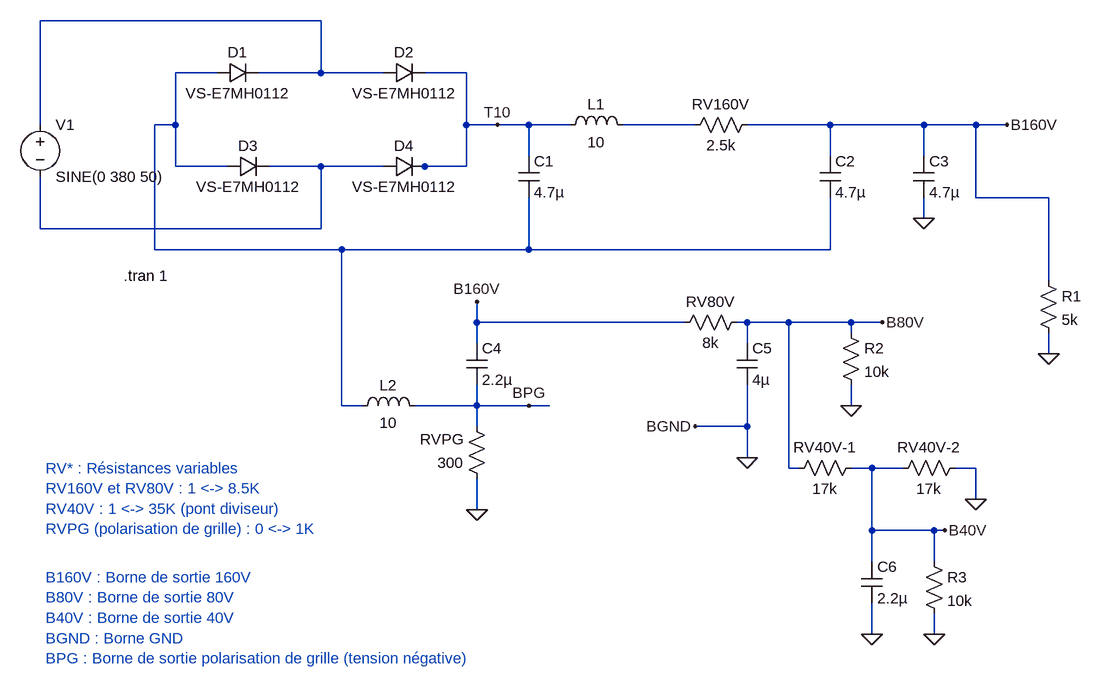
[diagram p0: schematic Ferrix-BL4-6.asc]
Ferrix-BL4-6.asc, the LTspice schematic file:
Version 4
SHEET 1 1728 952
WIRE 480 -32 48 -32
WIRE 320 48 256 48
WIRE 480 48 480 -32
WIRE 480 48 384 48
WIRE 576 48 480 48
WIRE 704 48 640 48
WIRE 48 128 48 -32
WIRE 256 128 256 48
WIRE 256 128 224 128
WIRE 704 128 704 48
WIRE 752 128 704 128
WIRE 800 128 752 128
WIRE 864 128 800 128
WIRE 1056 128 944 128
WIRE 1264 128 1136 128
WIRE 1408 128 1264 128
WIRE 1488 128 1408 128
WIRE 1536 128 1488 128
WIRE 800 176 800 128
WIRE 1264 176 1264 128
WIRE 1408 176 1408 128
WIRE 256 192 256 128
WIRE 336 192 256 192
WIRE 480 192 400 192
WIRE 576 192 480 192
WIRE 640 192 624 192
WIRE 704 192 704 128
WIRE 704 192 640 192
WIRE 1488 240 1488 128
WIRE 1600 240 1488 240
WIRE 1408 272 1408 240
WIRE 48 288 48 208
WIRE 480 288 480 192
WIRE 480 288 48 288
WIRE 224 320 224 128
WIRE 512 320 224 320
WIRE 800 320 800 240
WIRE 800 320 512 320
WIRE 1264 320 1264 240
WIRE 1264 320 800 320
WIRE 1600 368 1600 240
WIRE 720 432 720 400
WIRE 1040 432 720 432
WIRE 1136 432 1120 432
WIRE 1200 432 1136 432
WIRE 1296 432 1200 432
WIRE 1344 432 1296 432
WIRE 1296 448 1296 432
WIRE 720 464 720 432
WIRE 1136 464 1136 432
WIRE 1600 480 1600 448
WIRE 512 560 512 320
WIRE 544 560 512 560
WIRE 720 560 720 528
WIRE 720 560 624 560
WIRE 800 560 720 560
WIRE 832 560 800 560
WIRE 1296 560 1296 528
WIRE 720 592 720 560
WIRE 1136 592 1136 528
WIRE 1136 592 1056 592
WIRE 1136 640 1136 592
WIRE 1200 656 1200 432
WIRE 1216 656 1200 656
WIRE 1328 656 1296 656
WIRE 1376 656 1328 656
WIRE 1488 656 1456 656
WIRE 1488 704 1488 656
WIRE 720 720 720 672
WIRE 1328 752 1328 656
WIRE 1424 752 1328 752
WIRE 1440 752 1424 752
WIRE 1328 800 1328 752
WIRE 1424 800 1424 752
WIRE 1328 912 1328 864
WIRE 1424 912 1424 880
FLAG 1536 128 B160V
FLAG 1408 272 0
FLAG 720 400 B160V
FLAG 720 720 0
FLAG 800 560 BPG
FLAG 1344 432 B80V
FLAG 1136 640 0
FLAG 1488 704 0
FLAG 1056 592 BGND
FLAG 1328 912 0
FLAG 1440 752 B40V
FLAG 1600 480 0
FLAG 752 128 T10
FLAG 1296 560 0
FLAG 1424 912 0
SYMBOL voltage 48 112 R0
WINDOW 123 0 0 Left 0
WINDOW 39 0 0 Left 0
SYMATTR InstName V1
SYMATTR Value SINE(0 380 50)
SYMBOL diode 320 64 R270
WINDOW 0 32 32 VTop 2
WINDOW 3 0 32 VBottom 2
SYMATTR InstName D1
SYMATTR Value VS-E7MH0112
SYMBOL diode 576 64 R270
WINDOW 0 32 32 VTop 2
WINDOW 3 0 32 VBottom 2
SYMATTR InstName D2
SYMATTR Value VS-E7MH0112
SYMBOL diode 336 208 R270
WINDOW 0 32 32 VTop 2
WINDOW 3 0 32 VBottom 2
SYMATTR InstName D3
SYMATTR Value VS-E7MH0112
SYMBOL diode 576 208 R270
WINDOW 0 32 32 VTop 2
WINDOW 3 0 32 VBottom 2
SYMATTR InstName D4
SYMATTR Value VS-E7MH0112
SYMBOL res 1584 352 R0
SYMATTR InstName R1
SYMATTR Value 5k
SYMBOL ind 848 144 R270
WINDOW 0 32 56 VTop 2
WINDOW 3 5 56 VBottom 2
SYMATTR InstName L1
SYMATTR Value 10
SYMBOL cap 784 176 R0
SYMATTR InstName C1
SYMATTR Value 4.7µ
SYMBOL cap 1248 176 R0
SYMATTR InstName C2
SYMATTR Value 4.7µ
SYMBOL res 1152 112 R90
WINDOW 0 0 56 VBottom 2
WINDOW 3 32 56 VTop 2
SYMATTR InstName RV160V
SYMATTR Value 2.5k
SYMBOL ind 528 576 R270
WINDOW 0 32 56 VTop 2
WINDOW 3 5 56 VBottom 2
SYMATTR InstName L2
SYMATTR Value 10
SYMBOL cap 1392 176 R0
SYMATTR InstName C3
SYMATTR Value 4.7µ
SYMBOL cap 704 464 R0
SYMATTR InstName C4
SYMATTR Value 2.2µ
SYMBOL res 736 688 R180
WINDOW 0 36 76 Left 2
WINDOW 3 36 40 Left 2
SYMATTR InstName RVPG
SYMATTR Value 300
SYMBOL res 1136 416 R90
WINDOW 0 0 56 VBottom 2
WINDOW 3 32 56 VTop 2
SYMATTR InstName RV80V
SYMATTR Value 8k
SYMBOL cap 1120 464 R0
SYMATTR InstName C5
SYMATTR Value 4µ
SYMBOL res 1312 640 R90
WINDOW 0 0 56 VBottom 2
WINDOW 3 32 56 VTop 2
SYMATTR InstName RV40V-1
SYMATTR Value 17k
SYMBOL res 1472 640 R90
WINDOW 0 0 56 VBottom 2
WINDOW 3 32 56 VTop 2
SYMATTR InstName RV40V-2
SYMATTR Value 17k
SYMBOL cap 1312 800 R0
SYMATTR InstName C6
SYMATTR Value 2.2µ
SYMBOL res 1280 432 R0
SYMATTR InstName R2
SYMATTR Value 10k
SYMBOL res 1408 784 R0
SYMATTR InstName R3
SYMATTR Value 10k
TEXT 176 360 Left 2 !.tran 1
TEXT 56 656 Left 2 ;RV* : Résistances variables\nRV160V et RV80V : 1 <-> 8.5K\nRV40V : 1 <-> 35K (pont diviseur)\nRVPG (polarisation de grille) : 0 <-> 1K
TEXT 56 824 Left 2 ;B160V : Borne de sortie 160V\nB80V : Borne de sortie 80V\nB40V : Borne de sortie 40V\nBGND : Borne GND\nBPG : Borne de sortie polarisation de grille (tension négative)

The netlist it stands for:
* Ferrix-BL4-6.asc
V1 N001 N004 SINE(0 380 50)
D1 N002 N001 VS-E7MH0112
D2 N001 T10 VS-E7MH0112
D3 N002 N004 VS-E7MH0112
D4 N004 T10 VS-E7MH0112
R1 B160V 0 5k
L1 T10 N003 10
C1 T10 N002 4.7µ
C2 B160V N002 4.7µ
RV160V B160V N003 2.5k
L2 N002 BPG 10
C3 B160V 0 4.7µ
C4 B160V BPG 2.2µ
RVPG 0 BPG 300
RV80V B80V B160V 8k
C5 B80V 0 4µ
RV40V-1 B40V B80V 17k
RV40V-2 0 B40V 17k
C6 B40V 0 2.2µ
R2 B80V 0 10k
R3 B40V 0 10k
.model D D
.lib standard.dio
.tran 1
* RV* : Résistances variables
* RV160V et RV80V : 1 <-> 8.5K
* RV40V : 1 <-> 35K (pont diviseur)
* RVPG (polarisation de grille) : 0 <-> 1K
* B160V : Borne de sortie 160V
* B80V : Borne de sortie 80V
* B40V : Borne de sortie 40V
* BGND : Borne GND
* BPG : Borne de sortie polarisation de grille (tension négative)
.backanno
.end